# EAGLE schematic display-vfd13 (EAGLE 9.0.0)
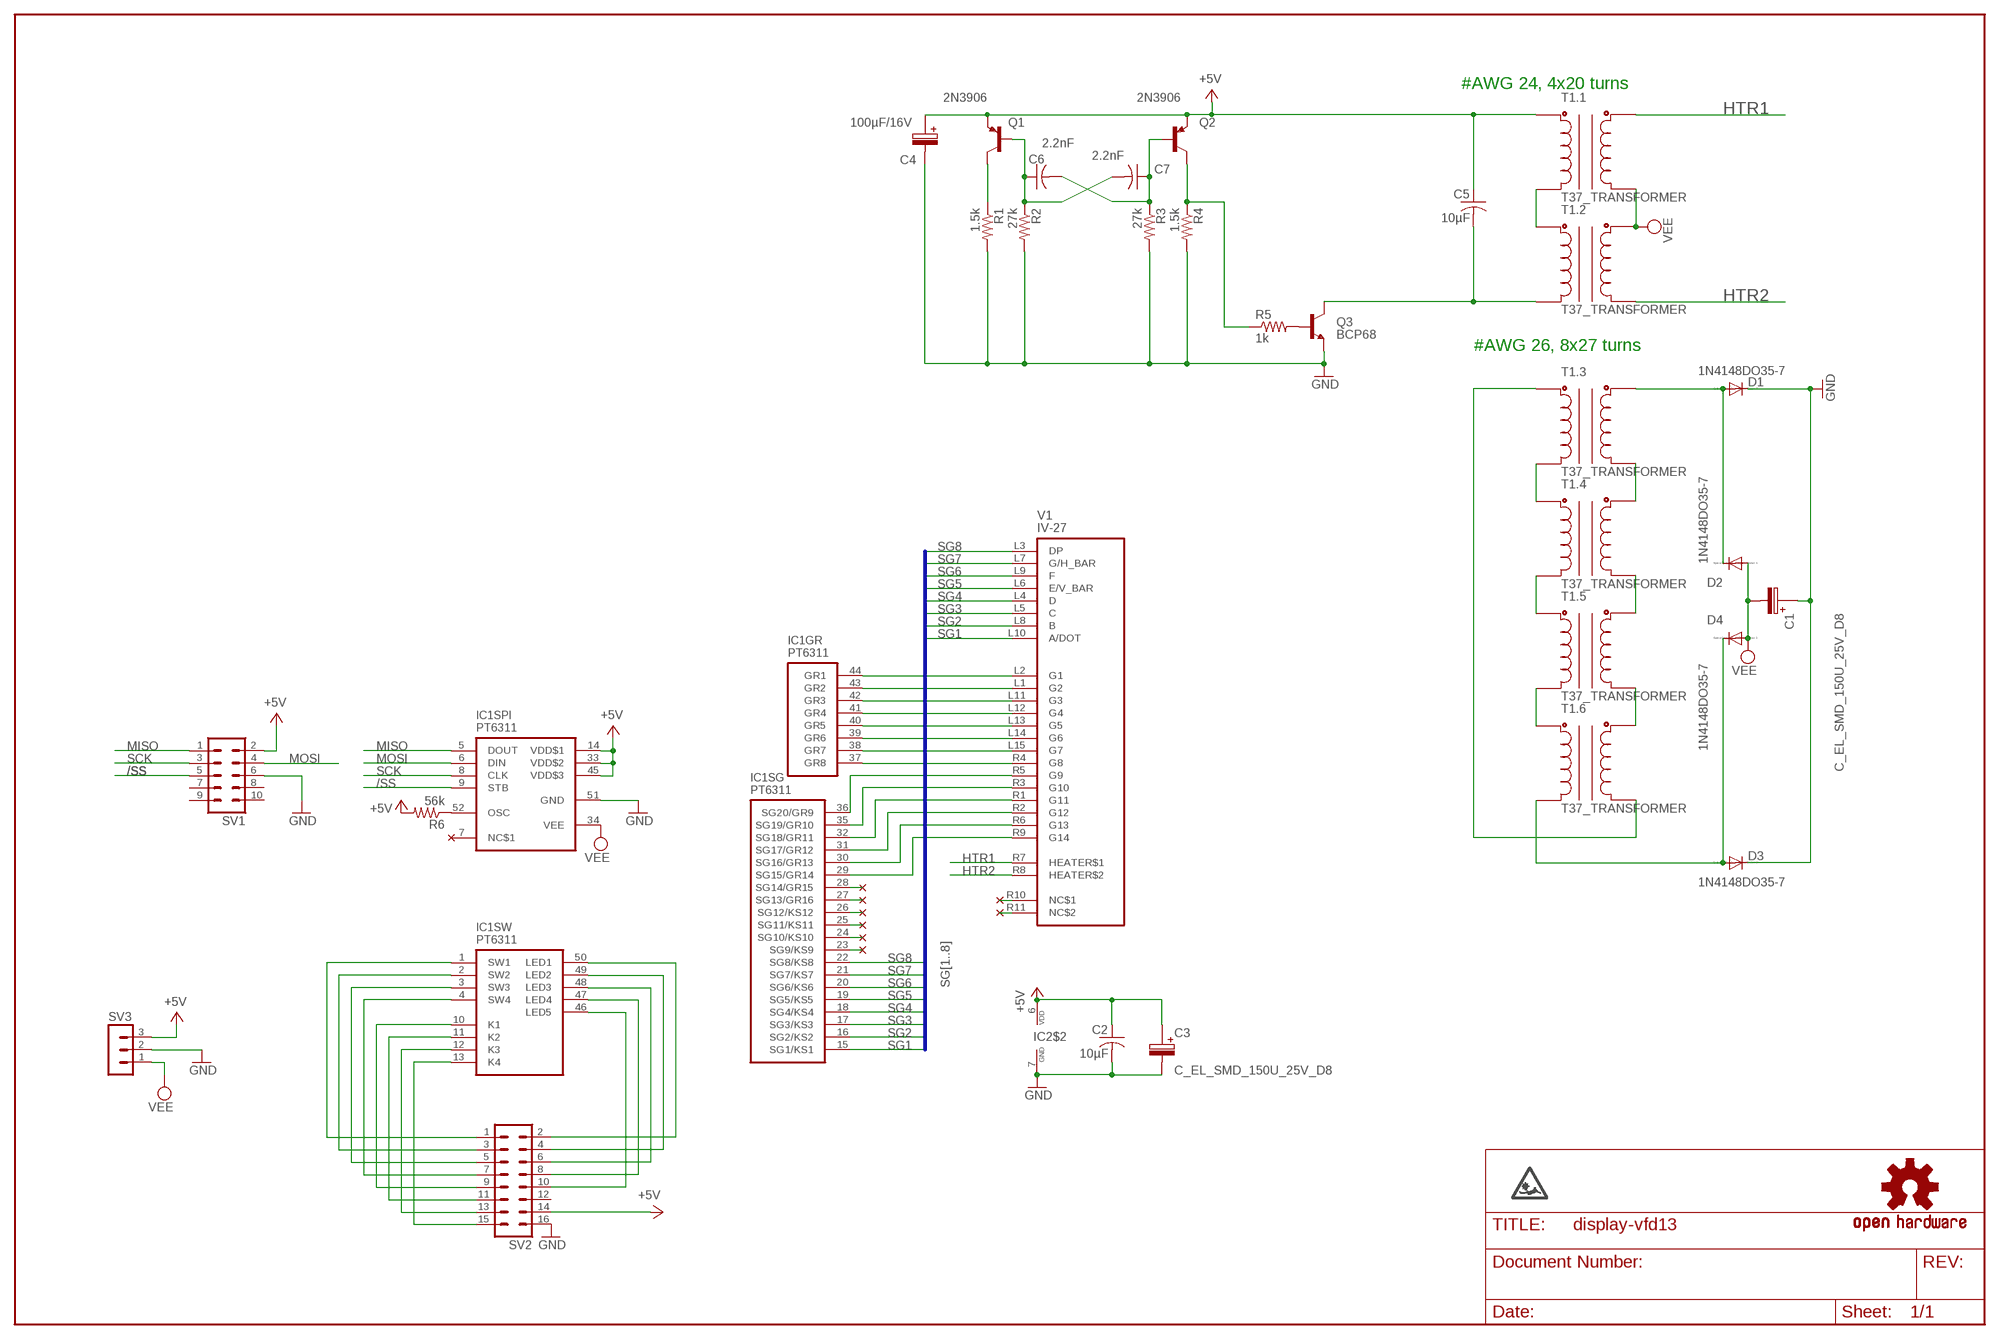
[diagram p0: schematic, sheet 1]

## Parts
C1  C_EL_SMD_150U_25V_D8  [PANASONIC_D]
C2  10µF  C-USC0805  [C0805]
C3  C_EL_SMD_150U_25V_D8  [PANASONIC_D]
C4  100µF/16V  C_EL_SMD_100U_16VD  [PANASONIC_D]
C5  10µF  C-USC0805  [C0805]
C6  2.2nF  C-USC0805  [C0805]
C7  2.2nF  C-USC0805  [C0805]
D1  1N4148DO35-7  [DO35-7]
D2  1N4148DO35-7  [DO35-7]
D3  1N4148DO35-7  [DO35-7]
D4  1N4148DO35-7  [DO35-7]
IC1  PT6311  [PQFP52]
IC2  LM9022M  [SO08]
Q1  2N3906  [TO92]
Q2  2N3906  [TO92]
Q3  BCP68  2N3904  [TO92]
R1  1.5k  R-US_R0805  [R0805]
R2  27k  R-US_R0805  [R0805]
R3  27k  R-US_R0805  [R0805]
R4  1.5k  R-US_R0805  [R0805]
R5  1k  R-US_R0805  [R0805]
R6  56k  R-US_R0805  [R0805]
SV1  MA05-2  [MA05-2]
SV2  MA08-2  [MA08-2]
SV3  MA03-1  [MA03-1]
T1.1  T37_TRANSFORMER  [T37_TRANSFORMER]
T1.2  T37_TRANSFORMER  [T37_TRANSFORMER]
T1.3  T37_TRANSFORMER  [T37_TRANSFORMER]
T1.4  T37_TRANSFORMER  [T37_TRANSFORMER]
T1.5  T37_TRANSFORMER  [T37_TRANSFORMER]
T1.6  T37_TRANSFORMER  [T37_TRANSFORMER]
U$10  OSHW-LOGOM  [OSHW-LOGO-M]
U$11  PHYSNOCT  [PHYSNOCT]
V1  IV-27  [IV-27]

## Nets
+5V: C2.1 C3.+ C4.+ C5.1 IC1.14(SPI:VDD$1) IC1.33(SPI:VDD$2) IC1.45(SPI:VDD$3) IC2.6($2:VDD) Q1.3(E) Q2.3(E) R6.2 SV1.2 SV2.14 SV3.3 T1.1.C1B
/SS: IC1.9(SPI:STB) SV1.5
GND: C1.+ C2.2 C3.- C4.- D1.C D3.C IC1.51(SPI:GND) IC2.7($2:GND) Q3.3(E) R1.2 R2.2 R3.2 R4.2 SV1.6 SV2.16 SV3.2
HTR1: T1.1.C2B V1.R7(HEATER$1)
HTR2: T1.2.C2A V1.R8(HEATER$2)
MISO: IC1.5(SPI:DOUT) SV1.1
MOSI: IC1.6(SPI:DIN) SV1.4
N$1: IC1.44(GR:GR1) V1.L2(G1)
N$2: IC1.43(GR:GR2) V1.L1(G2)
N$3: IC1.42(GR:GR3) V1.L11(G3)
N$4: IC1.41(GR:GR4) V1.L12(G4)
N$5: IC1.40(GR:GR5) V1.L13(G5)
N$6: IC1.39(GR:GR6) V1.L14(G6)
N$7: IC1.38(GR:GR7) V1.L15(G7)
N$8: IC1.37(GR:GR8) V1.R4(G8)
N$9: IC1.36(SG:SG20/GR9) V1.R5(G9)
N$10: IC1.35(SG:SG19/GR10) V1.R3(G10)
N$11: IC1.32(SG:SG18/GR11) V1.R1(G11)
N$12: IC1.31(SG:SG17/GR12) V1.R2(G12)
N$13: IC1.30(SG:SG16/GR13) V1.R6(G13)
N$14: IC1.29(SG:SG15/GR14) V1.R9(G14)
N$15: V1.R10(NC$1)
N$16: V1.R11(NC$2)
N$17: IC1.52(SPI:OSC) R6.1
N$18: T1.1.C1A T1.2.C1B
N$19: Q1.1(C) R1.1
N$20: D3.A D4.C T1.6.C1A
N$21: IC1.1(SW:SW1) SV2.1
N$22: IC1.28(SG:SG14/GR15)
N$26: IC1.2(SW:SW2) SV2.3
N$27: IC1.3(SW:SW3) SV2.5
N$28: IC1.4(SW:SW4) SV2.7
N$29: IC1.10(SW:K1) SV2.9
N$30: IC1.11(SW:K2) SV2.11
N$31: IC1.12(SW:K3) SV2.13
N$32: IC1.13(SW:K4) SV2.15
N$33: IC1.50(SW:LED1) SV2.2
N$34: IC1.49(SW:LED2) SV2.4
N$35: IC1.48(SW:LED3) SV2.6
N$36: IC1.47(SW:LED4) SV2.8
N$37: IC1.46(SW:LED5) SV2.10
N$38: D1.A D2.C T1.3.C2B
N$39: T1.3.C1A T1.4.C1B
N$40: T1.4.C1A T1.5.C1B
N$41: T1.5.C1A T1.6.C1B
N$42: T1.5.C2A T1.6.C2B
N$43: T1.4.C2A T1.5.C2B
N$44: T1.3.C2A T1.4.C2B
N$45: T1.3.C1B T1.6.C2A
N$46: C6.1 C7.2 Q1.2(B) R2.1
N$47: C6.2 C7.1 Q2.2(B) R3.1
N$48: Q2.1(C) R4.1 R5.1
N$49: Q3.2(B) R5.2
N$50: C5.2 Q3.1(C) T1.2.C1A
SCK: IC1.8(SPI:CLK) SV1.3
SG1: IC1.15(SG:SG1/KS1) V1.L10(A/DOT)
SG2: IC1.16(SG:SG2/KS2) V1.L8(B)
SG3: IC1.17(SG:SG3/KS3) V1.L5(C)
SG4: IC1.18(SG:SG4/KS4) V1.L4(D)
SG5: IC1.19(SG:SG5/KS5) V1.L6(E/V_BAR)
SG6: IC1.20(SG:SG6/KS6) V1.L9(F)
SG7: IC1.21(SG:SG7/KS7) V1.L7(G/H_BAR)
SG8: IC1.22(SG:SG8/KS8) V1.L3(DP)
VEE: C1.- D2.A D4.A IC1.34(SPI:VEE) SV3.1 T1.1.C2A T1.2.C2B
Unconnected: IC1.7(SPI:NC$1) IC1.23(SG:SG9/KS9) IC1.24(SG:SG10/KS10) IC1.25(SG:SG11/KS11) IC1.26(SG:SG12/KS12) IC1.27(SG:SG13/GR16) IC2.1($1:SHDN) IC2.2($1:BYPASS) IC2.3($1:+) IC2.4($1:-) IC2.5($1:O1) IC2.8($1:O2) SV1.7 SV1.8 SV1.9 SV1.10 SV2.12

## Buses
SG[1..8]

## Notes on the sheet
- #AWG 24, 4x20 turns
- #AWG 26, 8x27 turns

## Library data of the parts
C1 C3 = capacitors_smd_pol:C_EL_SMD: SMD Electrolitic Capacitor Panasonic Size Size Diameter Height mm mm A 0305 3 5.4 B 0405 4 5.4 C 0505 5 5.4 D 0605 6.3 5.4 D8 0608 6.3 7.7 E 0807 8 6.2 F 0810 8 10.2 G 1010 10.0 10.2; MPN: EEEFKE151XAP; OC_FARNELL: 1868407; PACKAGE: D8; SUPPLIER: PANASONIC
C2 C5-C7 = rcl:C-US: CAPACITOR, American symbol
C4 = capacitors_smd_pol:C_EL_SMD: SMD Electrolitic Capacitor Panasonic Size Size Diameter Height mm mm A 0305 3 5.4 B 0405 4 5.4 C 0505 5 5.4 D 0605 6.3 5.4 D8 0608 6.3 7.7 E 0807 8 6.2 F 0810 8 10.2 G 1010 10.0 10.2; MPN: EDK107M016A9GAA; OC_FARNELL: 2068653; PACKAGE: 0605; SUPPLIER: PANASONIC
D1-D4 = diode:1N4148: DIODE high speed (Philips)
IC1 = oldchips3:PT6311: VFD Driver/Controller IC
IC2 = newchips2:LM9022: Vacuum Fluorescent Display Filament Driver
Q1 Q2 = transistor-pnp:2N3906: PNP Transistor
Q3 = transistor-npn:2N3904: NPN Transistor
R1-R6 = rcl:R-US_: RESISTOR, American symbol
SV1 = con-lstb:MA05-2: PIN HEADER; OC_FARNELL: unknown; OC_NEWARK: unknown
SV2 = con-lstb:MA08-2: PIN HEADER; OC_FARNELL: unknown; OC_NEWARK: unknown
SV3 = con-lstb:MA03-1: PIN HEADER; OC_FARNELL: unknown; OC_NEWARK: unknown
T1.1-T1.6 = toroid:T37_TRANSFORMER: Transformer wound on a T37 Toroid
U$10 = SparkFun:OSHW-LOGO: Open Source Hardware Logo This logo indicates the piece of hardware it is found on incorporates a OSHW license and/or adheres to the definition of open source hardware found here: http://freedomdefined.org/OSHW
U$11 = physnoct:PHYSNOCT: Physnoct logo
V1 = IV-27:IV-27: 13-digit 7-segment display tube 5V heater, 24V grids and anodes